# Altium schematic sheet Sheet1.SchDoc
size A3; SheetNumber: 1; SheetTotal: 1
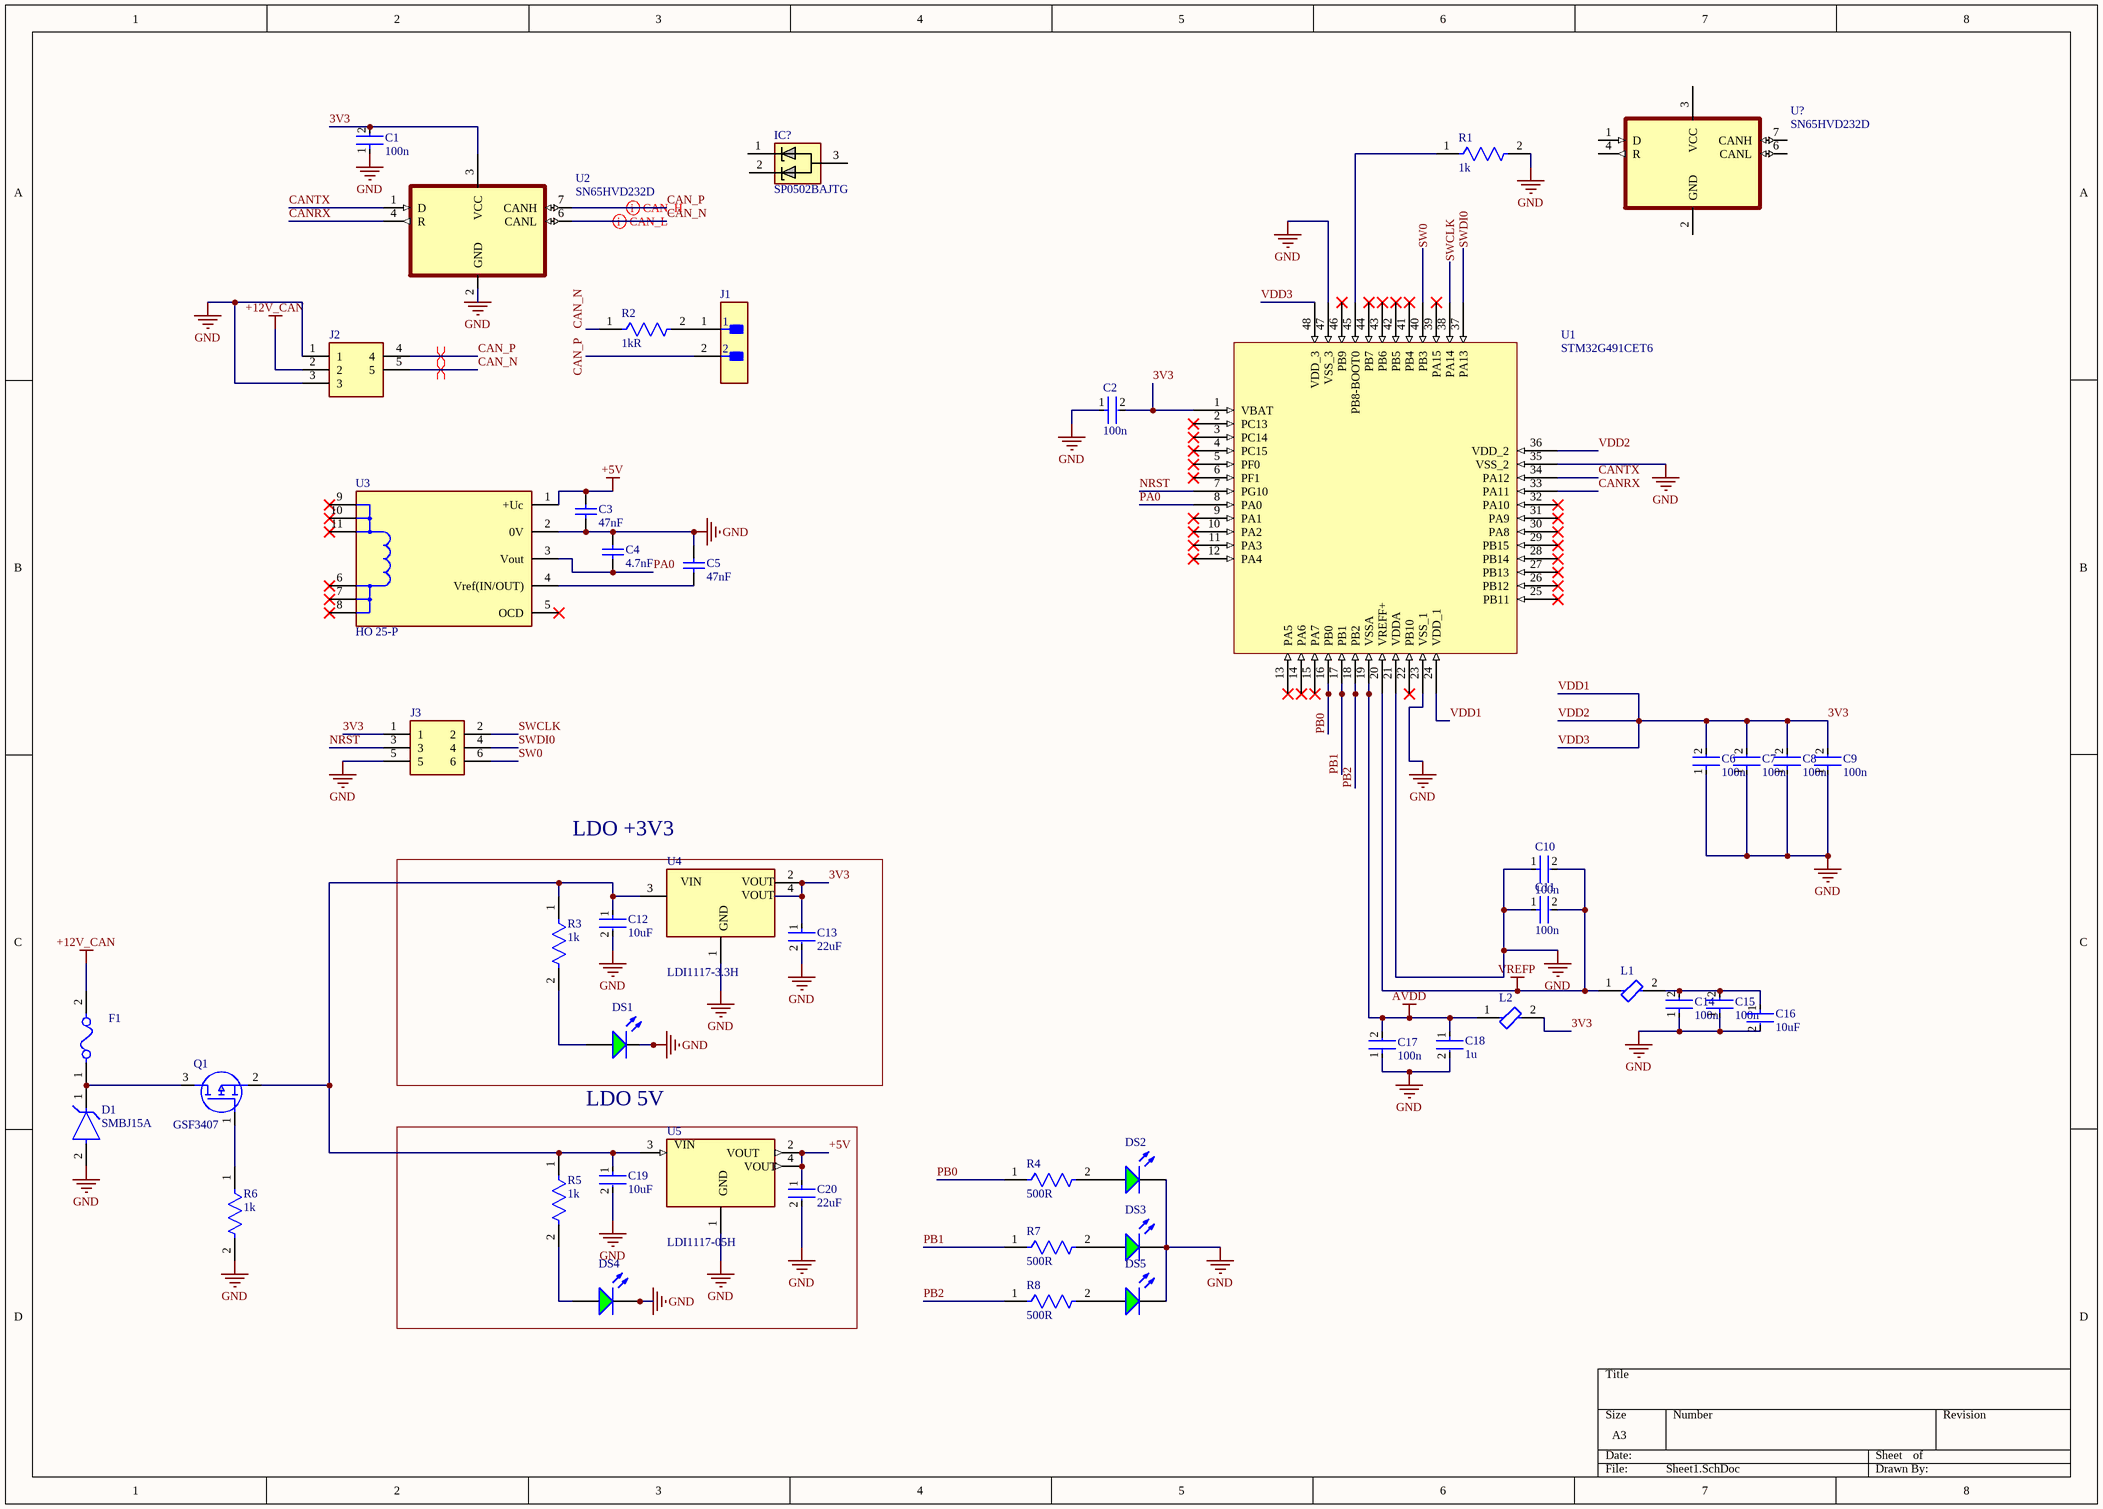
[diagram p0: Sheet1.SchDoc]

## Parts
C1  100n  [FP-C1206X104J3GACTU-MFG]
C2  100n  [FP-C1206X104J3GACTU-MFG]
C3  47nF  [CAPC1206(3216)170_N]
C4  4.7nF  [CAPC1206(3216)170_N]
C5  47nF  [CAPC1206(3216)170_N]
C6  100n  [FP-C1206X104J3GACTU-MFG]
C7  100n  [FP-C1206X104J3GACTU-MFG]
C8  100n  [FP-C1206X104J3GACTU-MFG]
C9  100n  [FP-C1206X104J3GACTU-MFG]
C10  100n  [FP-C1206X104J3GACTU-MFG]
C11  100n  [FP-C1206X104J3GACTU-MFG]
C12  10uF  [FP-GRM31C-0_2-e0_3_0_8-IPC_B]
C13  22uF  [FP-1206-L_3_2_0_2-W_1_6_0-IPC_A]
C14  100n  [FP-C1206X104J3GACTU-MFG]
C15  100n  [FP-C1206X104J3GACTU-MFG]
C16  10uF  [FP-GRM31C-0_2-e0_3_0_8-IPC_B]
C17  100n  [FP-C1206X104J3GACTU-MFG]
C18  1u  [FP-1206-L_3_2_0_2-W_1_6_0-IPC_A]
C19  10uF  [FP-GRM31C-0_2-e0_3_0_8-IPC_B]
C20  22uF  [FP-1206-L_3_2_0_2-W_1_6_0-IPC_A]
D1  SMBJ15A  [FP-SMBJ-MFG]
DS1  LTST-C230KGKT  [LTST-C230KGKT_V]  (value not drawn)
DS2  LTST-C230KGKT  [LTST-C230KGKT_V]  (value not drawn)
DS3  LTST-C230KGKT  [LTST-C230KGKT_V]  (value not drawn)
DS4  LTST-C230KGKT  [LTST-C230KGKT_V]  (value not drawn)
DS5  LTST-C230KGKT  [LTST-C230KGKT_V]  (value not drawn)
F1  0466.750NRHF  [FP-0466-MFG]  (value not drawn)
IC?  SP0502BAJTG  [SOT132P220X110-3N]
J1  TMM-102-03-T-S  [FP-TMM-102-03-T-S-MFG]  (value not drawn)
J2  M12A-05PMMR-SF7003  [M12A05PMMRSF7003]  (value not drawn)
J3  61200621621  [61200621621]  (value not drawn)
L1  MPZ1608S601ATA00  [FP-MPZ1608-0_8-MFG]  (value not drawn)
L2  MPZ1608S601ATA00  [FP-MPZ1608-0_8-MFG]  (value not drawn)
Q1  GSF3407  [AO3407A]
R1  1k  [FP-MCA1206-IPC_C]
R2  1kR  [FP-MCA1206-IPC_C]
R3  1k  [FP-MCA1206-IPC_C]
R4  500R  [FP-MCA1206-IPC_C]
R5  1k  [FP-MCA1206-IPC_C]
R6  1k  [FP-MCA1206-IPC_C]
R7  500R  [FP-MCA1206-IPC_C]
R8  500R  [FP-MCA1206-IPC_C]
U1  STM32G491CET6  [LQFP_491CET6_STM]
U2  SN65HVD232D  [SN65HVD232D]
U3  HO 25-P  [LEM HO 25-P]
U4  LDI1117-3.3H  [LDI1117-3.3H]
U5  LDI1117-05H  [LDI1117-05H]
U?  SN65HVD232D  [SN65HVD232D]

## Blocks framed on the sheet
LDO +3V3: C12 C13 DS1 R3 U4
LDO 5V: C19 C20 DS4 R5 U5

## Nets
+5V: C3.2 C20.1 U3.1(+Uc) U5.2 U5.4
+12V_CAN: F1.2 J2.2
AVDD: C17.2 C18.1 L2.1 U1.19(VSSA)
GND: C1.1 C2.1 C3.1 C4.2 C5.2 C6.1 C7.1 C8.1 C9.1 C10.1 C11.1 C12.2 C13.2 C14.1 C15.1 C16.2 C17.1 C18.2 C19.2 C20.2 D1.2(A) DS1.2(K) DS2.2(K) DS3.2(K) DS4.2(K) DS5.2(K) J2.1 J2.3 J3.5 R1.2 R6.2 U1.21(VDDA) U1.23(VSS_1) U1.35(VSS_2) U1.47(VSS_3) U2.2(GND) U3.2(0V) U4.1 U5.1
VREFP: C10.2 C11.2 L1.1 U1.20(VREFF+)
3V3: C1.2 C2.2 C6.2 C7.2 C8.2 C9.2 C13.1 J3.1 L2.2 U1.1(VBAT) U1.24(VDD_1) U1.36(VDD_2) U1.48(VDD_3) U2.3(VCC) U4.2 U4.4  [also labelled VDD1, VDD2, VDD3]
CAN_N: J2.5 R2.1 U2.6(CANL)
CAN_P: J1.2 J2.4 U2.7(CANH)
CANRX: U1.33(PA11) U2.4(R)
CANTX: U1.34(PA12) U2.1(D)
NRST: J3.3 U1.7(PG10)
PA0: C4.1 U1.8(PA0) U3.3(Vout)
PB0: R4.1 U1.16(PB0)
PB1: R7.1 U1.17(PB1)
PB2: R8.1 U1.18(PB2)
SW0: J3.6 U1.40(PB3)
SWCLK: J3.2 U1.38(PA14)
SWDI0: J3.4 U1.37(PA13)
NetC5_1: C5.1 U3.4(Vref(IN/OUT))
NetC12_1: C12.1 C19.1 Q1.2(S) R3.1 R5.1 U4.3 U5.3
NetC14_2: C14.2 C15.2 C16.1 L1.2
NetD1_1: D1.1(C) F1.1 Q1.3(D)
NetDS1_1: DS1.1(A) R3.2
NetDS2_1: DS2.1(A) R4.2
NetDS3_1: DS3.1(A) R7.2
NetDS4_1: DS4.1(A) R5.2
NetDS5_1: DS5.1(A) R8.2
NetJ1_1: J1.1 R2.2
NetQ1_1: Q1.1(G) R6.1
NetR1_1: R1.1 U1.45(PB8-BOOT0)

Not connected (* = marked no-connect by the designer): IC? 1 2 3; U1 2(PC13)* 3(PC14)* 4(PC15)* 5(PF0)* 6(PF1)* 9(PA1)* 10(PA2)* 11(PA3)* 12(PA4)* 13(PA5)* 14(PA6)* 15(PA7)* 22(PB10)* 25(PB11)* 26(PB12)* 27(PB13)* 28(PB14)* 29(PB15)* 30(PA8)* 31(PA9)* 32(PA10)* 39(PA15)* 41(PB4)* 42(PB5)* 43(PB6)* 44(PB7)* 46(PB9)*; U3 5(OCD)* 6(IN)* 7(IN)* 8(IN)* 9(OUT)* 10(OUT)* 11(OUT)*; U? 1(D) 2(GND) 3(VCC) 4(R) 6(CANL) 7(CANH)

## Layout directives
differential pair: CAN_N, CAN_P

## Notes on the sheet
- (in symbol LDI1117-3.3H) VIN; VOUT; GND
- (in symbol LDI1117-05H) VIN; VOUT; GND

## Library data of the parts
C1 C2 C6-C11 C14 C15 C17 = CMP-03020-034648-1: CAP CER 0.1UF 25V C0G/NP0 1206; RoHS Compliant: Yes
C3 C5 = CMP-1037-03987-1: CAP 47nF 50V ±20% 1206 (3216 Metric) Thickness 1.7mm SMD; Case-EIA: 1206; Tolerance: Â±20%; Case-Metric: 3216; Technology: SMT; Value: 47nF; Max Thickness: 1.7 mm; Rated Voltage: 50 V
C4 = CMP-1037-03115-1: CAP 4.7nF 50V ±5% 1206 (3216 Metric) Thickness 1.7mm SMD; Case-Metric: 3216; Case-EIA: 1206; Tolerance: Â±5%; Value: 4.7nF; Rated Voltage: 50 V; Technology: SMT; Max Thickness: 1.7 mm
C12 C16 C19 = CMP-06035-043219-1: Chip Multilayer Ceramic Capacitors for General Purpose, 1206, 10uF, X7R, 15%, 20%, 25V
C13 C20 = CMP-04427-020232-1: General Purpose Ceramic Capacitor, 1206, 22uF, 20%, X7R, 15%, 6.3V; Dissipation Factor: 5%; Width: 0.063inch; Min Operating Temperature: -55°C; Mount: Surface Mount; Case Code (Metric): 3216; Case/Package: 1206; Voltage Rating (DC): 6.3V; Package Quantity: 2500; RoHS Compliant: Yes; Depth: 1.6mm; Termination: SMD/SMT; Length: 3.2mm; Radiation Hardening: No; Max Operating Temperature: 125°C; Packaging: Tape and Reel; Voltage Rating: 6.3V; Construction: Flat; REACH SVHC: No SVHC; Case Code (Imperial): 1206; Lead Free: Lead Free; Height: 1.78mm; Capacitance: 22uF; Tolerance: 20%; Dielectric: X7R; Thickness: 0.07inch; Number of Pins: 2
C18 = CMP-04427-011252-1: Automotive Ceramic Capacitor, 1206, 1uF, 10%, X7R, 15%, 25V; Mount: Surface Mount; Case Code (Metric): 3216; Max Operating Temperature: 125°C; Tolerance: 10%; Dielectric: X7R; Thickness: 0.07inch; Termination: SMD/SMT; Radiation Hardening: No; Construction: Flat; Series: FLEXITERM®; Voltage Rating (DC): 25V; RoHS Compliant: Yes; Case/Package: 1206; Depth: 1.6mm; Height: 1.4mm; Capacitance: 1uF; Package Quantity: 2000; Voltage Rating: 25V; Packaging: Tape and Reel; Case Code (Imperial): 1206; Ratings: AEC-Q200; Features: Soft Termination; Width: 1.6mm; Min Operating Temperature: -55°C; Length: 3.2mm
D1 = CMP-07401-000033-1: TVS DIODE 15VWM 24.4VC SMB; Max Breakdown Voltage: 19.2V; Reverse Standoff Voltage: 15V; Number of Elements: 1; Diode Type: ZENER; Max Reverse Leakage Current: 5uA; Operating Supply Voltage: 3.5V; Element Configuration: Single; Reverse Breakdown Voltage: 16.7V; Peak Pulse Power: 600W; Peak Pulse Current: 24A; Polarity: Unidirectional; Clamping Voltage: 24.4V; ESD Protection: Yes; Test Current: 1mA; Power Line Protection: No; Max Surge Current: 100A; Min Operating Temperature: -55°C; Number of Pins: 2; Case/Package: DO-214AA; Number of Channels: 1; Series: SMBJ; Height: 2.42mm; Resistor Type: Zener; Max Power Dissipation: 600W; REACH SVHC: No SVHC; Package Quantity: 1; Breakdown Voltage: 19.2V; Radiation Hardening: No; Direction: Unidirectional; Number of Unidirectional Channels: 1; Termination: SMD/SMT; Length: 4.57mm; Width: 3.94mm; Packaging: Tape and Reel; Leakage Current: 5uA; RoHS Compliant: Yes; Mount: Surface Mount; Min Breakdown Voltage: 16.7V; Max Operating Temperature: 150°C
DS1-DS5 = CMP-2000-06625-1: LED Green, 75 mW, 30 mA, -30 to 85 degC, 2-Pin SMD, RoHS, Tape and Reel; Manufacturer: Lite-On; Product Length (mm): 3.2mm; Type: Uni-Color; Peak Wavelength: 574nm; Shape Type: Rectangular; DELETED: Compliant; Lum Intensity: 35mcd; Forward Voltage: 2.4V; High Brightness: Yes; Rad Hardened: No; Power Dissipation: 75W; Forward Current: 30mA; Emitting Color: YellowGreen; Main Category: ChipLED; Product Height (mm): 1.1mm; Product Depth (mm): 1.6mm; Number of  Elements: 1; Viewing Angle: 130deg; Chip Material: AlGaInP; Dominant Wave Length: 571nm; Test Current (It): 20mA; Reverse Voltage: 5V; Mounting: SurfaceMount; Datasheet URL: http://optoelectronics.liteon.com/upload/download/DS22-2000-256/S_110_LTST-C230KGKT.pdf; Luminous Intensity: 35mcd; Pin Count: 2; Mounting Technology: SurfaceMount; Operating Temperature Classification: Industrial; Operating Temp Range: -55Cto85C; Package Type: ChipLed; Manufacturer URL: http://www.us.liteon.com/; Package Description: 2-Pin Surface Mount Device, Body 3.2 x 1.6 mm; Package Reference: C230KGKT; Datasheet Version: Rev. G, 12/2014; Lens Dimensions: 1.5X1.6X0.82mm; Packaging: TapeandReel
F1 = CMP-08605-000088-1: FUSE BOARD MOUNT 750MA 63VAC/VDC; Voltage Rating (AC): 63V; Approvals: UL; Fuse Type: Board Mount (Cartridge Style Excluded); DC Cold Resistance: 111mR; Power Dissipation: 74mW; Case Code (Imperial): 1206; Case Code (Metric): 3216; Length: 3.18mm; Height: 0.023inch; Housing Material: Ceramic; Series: SlimLine™ 466; Voltage Rating (DC): 63V; Current Rating: 750mA; Min Operating Temperature: -50°C; Width: 0.06inch; Packaging: Tape and Reel; Depth: 1.52mm; Case/Package: 1206; Mount: Surface Mount; Max Operating Temperature: 90°C; Package Quantity: 5000; RoHS Compliant: Yes; Lead Free: Lead Free
IC? = SP0502BAJTG: Integrated Circuit; Manufacturer_Name: LITTELFUSE; Datasheet Link: https://www.littelfuse.com/~/media/electronics/datasheets/tvs_diode_arrays/littelfuse_tvs_diode_array_sp05_datasheet.pdf.pdf; Height: 1.1mm; Manufacturer_Part_Number: SP0502BAJTG; Mouser Part Number: 576-SP0502BAJTG; Mouser Price/Stock: https://www.mouser.co.uk/ProductDetail/Littelfuse/SP0502BAJTG?qs=RnOBYWd%2Fz7cttN1Mwg4HWA%3D%3D; Arrow Part Number: SP0502BAJTG; Arrow Price/Stock: https://www.arrow.com/en/products/sp0502bajtg/littelfuse?region=nac
J1 = CMP-02766-001621-1: Zwroka rezystora; Connector Type: Header; Max Voltage Rating (AC): 500V; Gender: Male; Number of Positions: 2; Pitch: 2mm; Max Current Rating: 3.9A; Series: TMM; Contact Plating: Tin; Depth: 1.97mm; Housing Material: Polymer; Contact Shape: Square; Contact Finish - Mating: TIN; Package Quantity: 1; Length: 4mm; Radiation Hardening: No; RoHS Compliant: Yes; Min Operating Temperature: -55°C; Max Operating Temperature: 105°C; Contact Material: Bronze; Lead Free: Lead Free; Color: Black; Termination: Solder; Number of Rows: 1; Contact Type: Male Pin; Contact Mating Length: 0.157inch; Insulation Material: Polymer; Number of Contacts: 2; Housing Color: Black; Insulation Color: Black; Orientation: Straight; REACH SVHC: No SVHC; Fastening Type: Pull; Packaging: Bulk; Mount: Through Hole
J2 = M12A-05PMMR-SF7003: M12, A Code, 4A, 05 pins, Male Contact, Hexagonal, M12*1.0, PCB 90ø, Front Fastened, IP67; Manufacturer_Name: Amphenol; Manufacturer: Amphenol LTW; Geometry.Height: 15mm; Connector Type: Signal; Number of Positions: 5; Voltage Rating: 60V; Manufacturer_Part_Number: M12A-05PMMR-SF7003; Mouser Part Number: 523-M12A05PMMRSF7003; Mouser Price/Stock: https://www.mouser.co.uk/ProductDetail/Amphenol-LTW/M12A-05PMMR-SF7003?qs=f9yNj16SXrIdWSE1H9dLLQ%3D%3D; Arrow Part Number: M12A-05PMMR-SF7003; Arrow Price/Stock: https://www.arrow.com/en/products/m12a-05pmmr-sf7003/amphenol?utm_currency=USD&region=nac; Datasheet Link: https://amphenolltw.com/down.php?prod_files=605433; Supplier: Avnet; Supplier Part Number: 50AC2957; Manufacturer Part Number: M12A-05PMMR-SF7003; RoHS: Compliant; Category: Circular Connectors; Stock: 32; Current Rating: 4A; Gender: Male; Lifecycle Status: Production; Pins: 5; ComponentLink1URL: https://datasheet.octopart.com:443/M12A-05PMMR-SF7003-Amphenol-datasheet-182346588.pdf?src-supplier=IHS; ComponentLink1Description: https://datasheet.octopart.com:443/M12A-05PMMR-SF7003-Amphenol-datasheet-182346588.pdf?src-supplier=IHS; ComponentLink2URL: https://datasheet.octopart.com:443/M12A-05PMMR-SF7003-Amphenol-LTW-datasheet-184719079.pdf?src-supplier=TME; ComponentLink2Description: https://datasheet.octopart.com:443/M12A-05PMMR-SF7003-Amphenol-LTW-datasheet-184719079.pdf?src-supplier=TME; ComponentLink3URL: https://datasheet.octopart.com:443/M12A-05PMMR-SF7003-Amphenol-LTW-datasheet-180194516.pdf?src-supplier=JRH+Electronics; ComponentLink3Description: https://datasheet.octopart.com:443/M12A-05PMMR-SF7003-Amphenol-LTW-datasheet-180194516.pdf?src-supplier=JRH+Electronics
J3 = 61200621621: Conn Shrouded Header (4 Sides) M 6 POS 2.54mm Solder ST Top Entry Thru-Hole Tray; Manufacturer_Name: Wurth Elektronik; Geometry.Height: 9.1mm; Connector Type: Male Pin; Contact Resistance: 20mΩ; Current Rating: 3A; Gender: Male; Insulation Resistance: 1GΩ; Number of Contacts: 6; Operating Supply Voltage: 250V; Manufacturer_Part_Number: 61200621621; Mouser Part Number: 710-61200621621; Mouser Price/Stock: https://www.mouser.co.uk/ProductDetail/Wurth-Elektronik/61200621621?qs=PhR8RmCirEbjX8n1RKw4Jw%3D%3D; Arrow Part Number: *; Arrow Price/Stock: *; Datasheet Link: https://katalog.we-online.de/em/datasheet/6120xx21621.pdf; Supplier: RS; Supplier Part Number: 8236430; Manufacturer: Wurth Elektronik; Manufacturer Part Number: 61200621621; RoHS: Compliant; Category: Headers and Wire Housings; Stock: 450; Color: Black; Contact Material: Copper; Contact Plating: Gold; Insulation Material: PBT; Lead Pitch: 2.54mm; Length: 15.28mm; Max Operating Temperature: 105°C; Min Operating Temperature: -40°C; Mounting Technology: Through Hole; Pins: 6; Number of Positions: 6; Number of Rows: 2; Orientation: Vertical; Pitch: 2.54mm; Row Spacing: 2.54mm; Termination: Solder; ComponentLink1URL: https://datasheet.octopart.com:443/61200621621-Wurth-Elektronik-datasheet-168479915.pdf?src-supplier=Newark; ComponentLink1Description: https://datasheet.octopart.com:443/61200621621-Wurth-Elektronik-datasheet-168479915.pdf?src-supplier=Newark; ComponentLink2URL: https://datasheet.octopart.com:443/61200621621-W%C3%BCrth-Elektronik-datasheet-5367532.pdf?src-supplier=Newark; ComponentLink2Description: https://datasheet.octopart.com:443/61200621621-W%C3%BCrth-Elektronik-datasheet-5367532.pdf?src-supplier=Newark; ComponentLink3URL: https://datasheet.octopart.com:443/61200621621-W%C3%BCrth-Elektronik-datasheet-62127819.pdf?src-supplier=Upverter; ComponentLink3Description: https://datasheet.octopart.com:443/61200621621-W%C3%BCrth-Elektronik-datasheet-62127819.pdf?src-supplier=Upverter; ComponentLink4URL: https://datasheet.octopart.com:443/61200621621-W%C3%BCrth-Elektronik-datasheet-111087935.pdf?src-supplier=Wurth+Elektronik; ComponentLink4Description: https://datasheet.octopart.com:443/61200621621-W%C3%BCrth-Elektronik-datasheet-111087935.pdf?src-supplier=Wurth+Elektronik; ComponentLink5URL: https://datasheet.octopart.com:443/61200621621-W%C3%BCrth-Elektronik-datasheet-149523874.pdf?src-supplier=Farnell; ComponentLink5Description: https://datasheet.octopart.com:443/61200621621-W%C3%BCrth-Elektronik-datasheet-149523874.pdf?src-supplier=Farnell
L1 L2 = CMP-08257-000179-1: Power line Ferrite Bead 600Ω @ 100MHz 1A DCR 0.15Ω SMD 0603; Impedance: 600R; DC Resistance (DCR): 150mR; Tolerance: 25%; Depth: 0.8mm; Packaging: Tape and Reel; Package Quantity: 4000; Height: 0.8mm; Length: 0.063inch; Series: MPZ; Weight: 7.1E-05oz; Width: 0.8mm; Mount: Surface Mount; Case Code (Imperial): 0603; Case/Package: 0603; Max Operating Temperature: 125°C; Max DC Current: 1A; Test Frequency: 100MHz; Min Operating Temperature: -55°C; Current Rating: 1A; Core Material: Ferrite; RoHS Compliant: Yes; REACH SVHC: No SVHC; Case Code (Metric): 1608; Termination: SMD/SMT; Lead Free: Lead Free
Q1 = AO3407A: Trans Mosfet P-ch 30V 4.3A 3-PIN SOT-23 / Mosfet P-ch 30V 4.3A SOT23; Manufacturer_Name: Alpha & Omega Semiconductors; Manufacturer: Alpha & Omega Semiconductor; Geometry.Height: 1.25mm; Drain to Source Resistance: 48mΩ; Gate to Source Voltage (Vgs): 20V; Input Capacitance: 830pF; Max Power Dissipation: 1.4W; Number of Elements: 1; Manufacturer_Part_Number: AO3407A; Mouser Part Number: *; Mouser Price/Stock: *; Arrow Part Number: AO3407A; Arrow Price/Stock: https://www.arrow.com/en/products/ao3407a/alpha-and-omega-semiconductor?utm_currency=USD&region=nac; Datasheet Link: http://www.aosmd.com/pdfs/datasheet/ao3407a.pdf; Supplier: DigiKey; Supplier Part Number: 785-1006-1-ND; Manufacturer Part Number: AO3407A; RoHS: Compliant; Category: MOSFETs; Stock: 638444; Pricing: 1=0,46, 10=0,282, 100=0,1787, 500=0,1337, 1000=0,11915 (USD); Case/Package: SOT-23; Continuous Drain Current (ID): 4.3A; Drain to Source Voltage (Vdss): 30V; Lead Free: Lead Free; Lifecycle Status: Production; Max Operating Temperature: 150°C; Min Breakdown Voltage: 30V; Min Operating Temperature: -55°C; Mounting Technology: Surface Mount; Pins: 3; Number of Terminals: 3; Power Dissipation: 1.4W; Radiation Hardening: No; Rds On Max: 48mΩ; REACH SVHC: Yes; Schedule B: 8541290080, 8541290080|8541290080|8541290080|8541290080|8541290080; ComponentLink1URL: https://datasheet.octopart.com:443/AO3407A-Alpha-%26-Omega-Semiconductor-datasheet-17018024.pdf?src-supplier=IHS; ComponentLink1Description: https://datasheet.octopart.com:443/AO3407A-Alpha-%26-Omega-Semiconductor-datasheet-17018024.pdf?src-supplier=IHS; ComponentLink2URL: https://sigma.octopart.com:443/140150677/technical_drawing/Alpha-%26-Omega-Semiconductor-AO3407A.pdf?src-supplier=Alpha+%26+Omega+Semiconductor+SCT; ComponentLink2Description: https://sigma.octopart.com:443/140150677/technical_drawing/Alpha-%26-Omega-Semiconductor-AO3407A.pdf?src-supplier=Alpha+%26+Omega+Semiconductor+SCT; ComponentLink3URL: https://datasheet.octopart.com:443/AO3407A-Alpha-%26-Omega-Semiconductor-datasheet-14060812.pdf?src-supplier=iiiC; ComponentLink3Description: https://datasheet.octopart.com:443/AO3407A-Alpha-%26-Omega-Semiconductor-datasheet-14060812.pdf?src-supplier=iiiC; ComponentLink4URL: https://datasheet.octopart.com:443/AO3407A-Alpha-%26-Omega-Semiconductor-datasheet-5389863.pdf?src-supplier=Verical; ComponentLink4Description: https://datasheet.octopart.com:443/AO3407A-Alpha-%26-Omega-Semiconductor-datasheet-5389863.pdf?src-supplier=Verical
R1 R3 R5 R6 = CMP-02407-001586-1: Res MC AT Precision Thin Film 1206 1kΩ 0.1% 0.4W ±25ppm/°C Molded Paper T/R; Max Power Dissipation: 400mW; Voltage Rating: 200V; Resistance: 1kR; Min Operating Temperature: -55°C; Lead Free: Lead Free; Case Code (Metric): 3216; Tolerance: 0.1%; Termination: SMD/SMT; Max Operating Temperature: 155°C; Packaging: Tape and Reel; Features: Automotive AEC-Q200; Case Code (Imperial): 1206; Length: 0.126inch; Weight: 0.000353oz; Composition: Thin Film; Case/Package: 1206; Height: 0.026inch; Power Rating: 400mW; Width: 0.063inch; Temperature Coefficient: 25ppm/°C; Number of Terminations: 2; Package Quantity: 1000
R2 = CMP-02407-001586-1: Res MC AT Precision Thin Film 1206 1kΩ 0.1% 0.4W ±25ppm/°C Molded Paper T/R; Max Power Dissipation: 400mW; Voltage Rating: 200V; Min Operating Temperature: -55°C; Lead Free: Lead Free; Case Code (Metric): 3216; Tolerance: 0.1%; Termination: SMD/SMT; Max Operating Temperature: 155°C; Packaging: Tape and Reel; Features: Automotive AEC-Q200; Case Code (Imperial): 1206; Resistance: 1kR; Length: 0.126inch; Weight: 0.000353oz; Composition: Thin Film; Case/Package: 1206; Height: 0.026inch; Power Rating: 400mW; Width: 0.063inch; Temperature Coefficient: 25ppm/°C; Number of Terminations: 2; Package Quantity: 1000
R4 R7 R8 = CMP-02407-005036-1: Res MC Precision Thin Film 1206 500Ω 0.1% 0.25W ±25ppm/°C Molded Paper T/R; Max Power Dissipation: 250mW; Min Operating Temperature: -55°C; Length: 0.126inch; Packaging: Tape and Reel; Composition: Thin Film; Width: 0.063inch; Height: 0.026inch; Package Quantity: 5000; Number of Terminations: 2; Lead Free: Lead Free; Temperature Coefficient: 25ppm/°C; Case/Package: 1206; Max Operating Temperature: 125°C; Resistance: 500R; Tolerance: 0.1%; Depth: 1.6mm; Military Standard: Not
U2 U? = SN65HVD232D: Texas Instruments - SN65HVD232DR - Can Transceiver, 1MBPS, 1/1, 3.3V, SOIC-8, Full Reel; Manufacturer Lifecycle Status: ACTIVE; Max Supply Voltage: 3.6V; Min Supply Voltage: 3V; Nominal Supply Current: 17mA; Number of Drivers: 1; SnapEDA_Link: https://www.snapeda.com/parts/SN65HVD232D/Texas+Instruments/view-part/?ref=snap; Package: SOIC-8 Texas Instruments; Value: *; MF: Texas Instruments; MP: SN65HVD232D; Check_prices: https://www.snapeda.com/parts/SN65HVD232D/Texas+Instruments/view-part/?ref=eda; Supplier: Arrow Electronics; Supplier Part Number: SN65HVD232DR; Manufacturer: Texas Instruments; Manufacturer Part Number: SN65HVD232DR; RoHS: Compliant; Category: CAN Transceivers; Stock: 10000; Pricing: 2500=1,1159, 5000=1,076, 7500=1,062 (USD); Case/Package: SOIC; Data Rate: 1Mbps; Height: 1.75mm; Lead Free: Lead Free; Length: 4.9mm; Lifecycle Status: Production; Max Operating Temperature: 85°C; Min Operating Temperature: -40°C; Pins: 8; Number of Receive Buffers: 1; Number of Receivers: 1; Number of Transceivers: 1; Number of Transmit Buffers: 1; Packaging: Cut Tape; Radiation Hardening: No; REACH SVHC: No; Schedule B: 8542390000, 8542390000|8542390000|8542390000|8542390000|8542390000; Thickness: 1.58mm; Weight: 72.603129mg; Width: 3.91mm; ComponentLink1URL: https://octopart.com:443/opatz8j6/c1?t=KNMFt9M64p-_id6rZ0-P1CX6CGmvk_NFg0bt7DHXbi_P10EFF0MZE_9gM8ERckOxIywTBgDrXd4Bw1XwEAcVVdK92p9CEfdSNaVajf6_bxnez3EeN1RE1wZBaojbXTwQ_101S7Bb856c3hUAWErS0_zGIM1B6Z6dFQwv_Ps2SUdVVUCjmJkLnMLZKTBWfnIVcgJIheW78JYanUyW_1u-I93chBuiSPXQYIk2xXb9JgOyrE9lHEnesRSQq9luJOd1yknyGQP0N3Is0_dGM9QrGV5UOgjoada9tMnQwKJP8gahr3iTK59XJFH6OfbHTOm3R9BdESCrBMbrE2MVOGPPkVOTrqf0YMovDpmf-konbncFnSES8CNOhHqMwHv2HEwKcPoK44nl&src-supplier=Texas+Instruments; ComponentLink1Description: https://octopart.com:443/opatz8j6/c1?t=KNMFt9M64p-_id6rZ0-P1CX6CGmvk_NFg0bt7DHXbi_P10EFF0MZE_9gM8ERckOxIywTBgDrXd4Bw1XwEAcVVdK92p9CEfdSNaVajf6_bxnez3EeN1RE1wZBaojbXTwQ_101S7Bb856c3hUAWErS0_zGIM1B6Z6dFQwv_Ps2SUdVVUCjmJkLnMLZKTBWfnIVcgJIheW78JYanUyW_1u-I93chBuiSPXQYIk2xXb9JgOyrE9lHEnesRSQq9luJOd1yknyGQP0N3Is0_dGM9QrGV5UOgjoada9tMnQwKJP8gahr3iTK59XJFH6OfbHTOm3R9BdESCrBMbrE2MVOGPPkVOTrqf0YMovDpmf-konbncFnSES8CNOhHqMwHv2HEwKcPoK44nl&src-supplier=Texas+Instruments; ComponentLink2URL: https://sigma.octopart.com:443/49249642/technical_drawing/Texas-Instruments-SN65HVD232DR.pdf?src-supplier=Texas+Instruments; ComponentLink2Description: https://sigma.octopart.com:443/49249642/technical_drawing/Texas-Instruments-SN65HVD232DR.pdf?src-supplier=Texas+Instruments; ComponentLink3URL: https://datasheet.octopart.com:443/SN65HVD232DR-Texas-Instruments-datasheet-81447765.pdf?src-supplier=Upverter; ComponentLink3Description: https://datasheet.octopart.com:443/SN65HVD232DR-Texas-Instruments-datasheet-81447765.pdf?src-supplier=Upverter; ComponentLink4URL: https://datasheet.octopart.com:443/SN65HVD232DR-Texas-Instruments-datasheet-37140773.pdf?src-supplier=Newark; ComponentLink4Description: https://datasheet.octopart.com:443/SN65HVD232DR-Texas-Instruments-datasheet-37140773.pdf?src-supplier=Newark; ComponentLink5URL: https://datasheet.octopart.com:443/SN65HVD232DR-Texas-Instruments-datasheet-14436966.pdf?src-supplier=Newark; ComponentLink5Description: https://datasheet.octopart.com:443/SN65HVD232DR-Texas-Instruments-datasheet-14436966.pdf?src-supplier=Newark; ComponentLink6URL: https://datasheet.octopart.com:443/SN65HVD232DR-Texas-Instruments-datasheet-58296547.pdf?src-supplier=Newark; ComponentLink6Description: https://datasheet.octopart.com:443/SN65HVD232DR-Texas-Instruments-datasheet-58296547.pdf?src-supplier=Newark; ComponentLink7URL: https://datasheet.octopart.com:443/SN65HVD232DR-Texas-Instruments-datasheet-48117850.pdf?src-supplier=Newark; ComponentLink7Description: https://datasheet.octopart.com:443/SN65HVD232DR-Texas-Instruments-datasheet-48117850.pdf?src-supplier=Newark; ComponentLink8URL: https://datasheet.octopart.com:443/SN65HVD232DR-Texas-Instruments-datasheet-10256024.pdf?src-supplier=Arrow+Electronics; ComponentLink8Description: https://datasheet.octopart.com:443/SN65HVD232DR-Texas-Instruments-datasheet-10256024.pdf?src-supplier=Arrow+Electronics; ComponentLink9URL: https://datasheet.octopart.com:443/SN65HVD232DR-Texas-Instruments-datasheet-149765.pdf?src-supplier=Mouser; ComponentLink9Description: https://datasheet.octopart.com:443/SN65HVD232DR-Texas-Instruments-datasheet-149765.pdf?src-supplier=Mouser; ComponentLink10URL: https://datasheet.octopart.com:443/SN65HVD232DR-Texas-Instruments-datasheet-62292544.pdf?src-supplier=Farnell; ComponentLink10Description: https://datasheet.octopart.com:443/SN65HVD232DR-Texas-Instruments-datasheet-62292544.pdf?src-supplier=Farnell; ComponentLink11URL: https://datasheet.octopart.com:443/SN65HVD232DR-Texas-Instruments-datasheet-164416263.pdf?src-supplier=SHENGYU+ELECTRONICS; ComponentLink11Description: https://datasheet.octopart.com:443/SN65HVD232DR-Texas-Instruments-datasheet-164416263.pdf?src-supplier=SHENGYU+ELECTRONICS; ComponentLink12URL: https://datasheet.octopart.com:443/SN65HVD232DR-Texas-Instruments-datasheet-159115712.pdf?src-supplier=LCSC; ComponentLink12Description: https://datasheet.octopart.com:443/SN65HVD232DR-Texas-Instruments-datasheet-159115712.pdf?src-supplier=LCSC; ComponentLink13URL: https://datasheet.octopart.com:443/SN65HVD232DR-Texas-Instruments-datasheet-137316104.pdf?src-supplier=Future+Electronics; ComponentLink13Description: https://datasheet.octopart.com:443/SN65HVD232DR-Texas-Instruments-datasheet-137316104.pdf?src-supplier=Future+Electronics; ComponentLink14URL: https://datasheet.octopart.com:443/SN65HVD232DR-Texas-Instruments-datasheet-8625468.pdf?src-supplier=Verical; ComponentLink14Description: https://datasheet.octopart.com:443/SN65HVD232DR-Texas-Instruments-datasheet-8625468.pdf?src-supplier=Verical; ComponentLink15URL: https://datasheet.octopart.com:443/SN65HVD232DR-Texas-Instruments-datasheet-8378736.pdf?src-supplier=Verical; ComponentLink15Description: https://datasheet.octopart.com:443/SN65HVD232DR-Texas-Instruments-datasheet-8378736.pdf?src-supplier=Verical; ComponentLink16URL: http://sigma.octopart.com:80/conflict_mineral_statement/Texas-Instruments-company-63.pdf?src-supplier=Compliance+Statements; ComponentLink16Description: http://sigma.octopart.com:80/conflict_mineral_statement/Texas-Instruments-company-63.pdf?src-supplier=Compliance+Statements; ComponentLink17URL: http://sigma.octopart.com:80/reach_statement/Texas-Instruments-company-64.pdf?src-supplier=Compliance+Statements; ComponentLink17Description: http://sigma.octopart.com:80/reach_statement/Texas-Instruments-company-64.pdf?src-supplier=Compliance+Statements
U3 = LEM HO 25-P_1: Current Sensor 25A 1 Channel Hall Effect, Open Loop Bidirectional Module, Single Pass Through
U4 = LDI1117-3.3H: Fixed Positive LDO Regulator; Manufacturer: Diotec; Supplier: Mouser; Supplier Part Number: 637-LDI1117-3.3H; Manufacturer Part Number: LDI1117-3.3H; RoHS: No; Category: Voltage Regulators - Linear; Stock: 5056; Pricing: 1=0,4, 10=0,286, 50=0,286, 100=0,199, 1000=0,163, 10000=0,089 (USD); ComponentLink1URL: https://datasheet.octopart.com/LDI1117-3.3H-Diotec-datasheet-154607892.pdf?src-supplier=TME; ComponentLink1Description: https://datasheet.octopart.com/LDI1117-3.3H-Diotec-datasheet-154607892.pdf?src-supplier=TME; ComponentLink2URL: https://datasheet.octopart.com/LDI1117-3.3H-Diotec-datasheet-159101088.pdf?src-supplier=SOS+electronic; ComponentLink2Description: https://datasheet.octopart.com/LDI1117-3.3H-Diotec-datasheet-159101088.pdf?src-supplier=SOS+electronic; ComponentLink3URL: https://datasheet.octopart.com/LDI1117-3.3H-Diotec-datasheet-189099648.pdf?src-supplier=Master+Electronics; ComponentLink3Description: https://datasheet.octopart.com/LDI1117-3.3H-Diotec-datasheet-189099648.pdf?src-supplier=Master+Electronics
U5 = LDI1117-05H: Fixed Positive LDO Regulator; Manufacturer: Diotec; Supplier: Farnell; Supplier Part Number: 4553249; Manufacturer Part Number: LDI1117-05H; RoHS: No; Category: Voltage Regulators - Linear; Stock: 720; RoHS Compliant: Yes; ComponentLink1URL: http://datasheet.octopart.com/LDI1117-05H-Diotec-datasheet-154607892.pdf?src-supplier=Mouser; ComponentLink1Description: http://datasheet.octopart.com/LDI1117-05H-Diotec-datasheet-154607892.pdf?src-supplier=Mouser; ComponentLink2URL: http://datasheet.octopart.com/LDI1117-05H-Diotec-datasheet-154607892.pdf?src-supplier=Distrelec; ComponentLink2Description: http://datasheet.octopart.com/LDI1117-05H-Diotec-datasheet-154607892.pdf?src-supplier=Distrelec; ComponentLink3URL: http://datasheet.octopart.com/LDI1117-05H-Diotec-datasheet-154607892.pdf?src-supplier=Onlinecomponents.com; ComponentLink3Description: http://datasheet.octopart.com/LDI1117-05H-Diotec-datasheet-154607892.pdf?src-supplier=Onlinecomponents.com; ComponentLink4URL: http://datasheet.octopart.com/LDI1117-05H-Diotec-datasheet-154607892.pdf?src-supplier=DComponents; ComponentLink4Description: http://datasheet.octopart.com/LDI1117-05H-Diotec-datasheet-154607892.pdf?src-supplier=DComponents; ComponentLink5URL: https://datasheet.octopart.com/LDI1117-05H-Diotec-datasheet-154607892.pdf?src-supplier=TME; ComponentLink5Description: https://datasheet.octopart.com/LDI1117-05H-Diotec-datasheet-154607892.pdf?src-supplier=TME; ComponentLink6URL: https://datasheet.octopart.com/LDI1117-05H-Diotec-datasheet-159101088.pdf?src-supplier=SOS+electronic; ComponentLink6Description: https://datasheet.octopart.com/LDI1117-05H-Diotec-datasheet-159101088.pdf?src-supplier=SOS+electronic; ComponentLink7URL: http://datasheet.octopart.com/LDI1117-05H-Diotec-datasheet-154607892.pdf?src-supplier=Electro+Sonic; ComponentLink7Description: http://datasheet.octopart.com/LDI1117-05H-Diotec-datasheet-154607892.pdf?src-supplier=Electro+Sonic; ComponentLink8URL: https://datasheet.octopart.com/LDI1117-05H-Diotec-datasheet-189099648.pdf?src-supplier=Master+Electronics; ComponentLink8Description: https://datasheet.octopart.com/LDI1117-05H-Diotec-datasheet-189099648.pdf?src-supplier=Master+Electronics